# Altium project piRack.PrjPCB
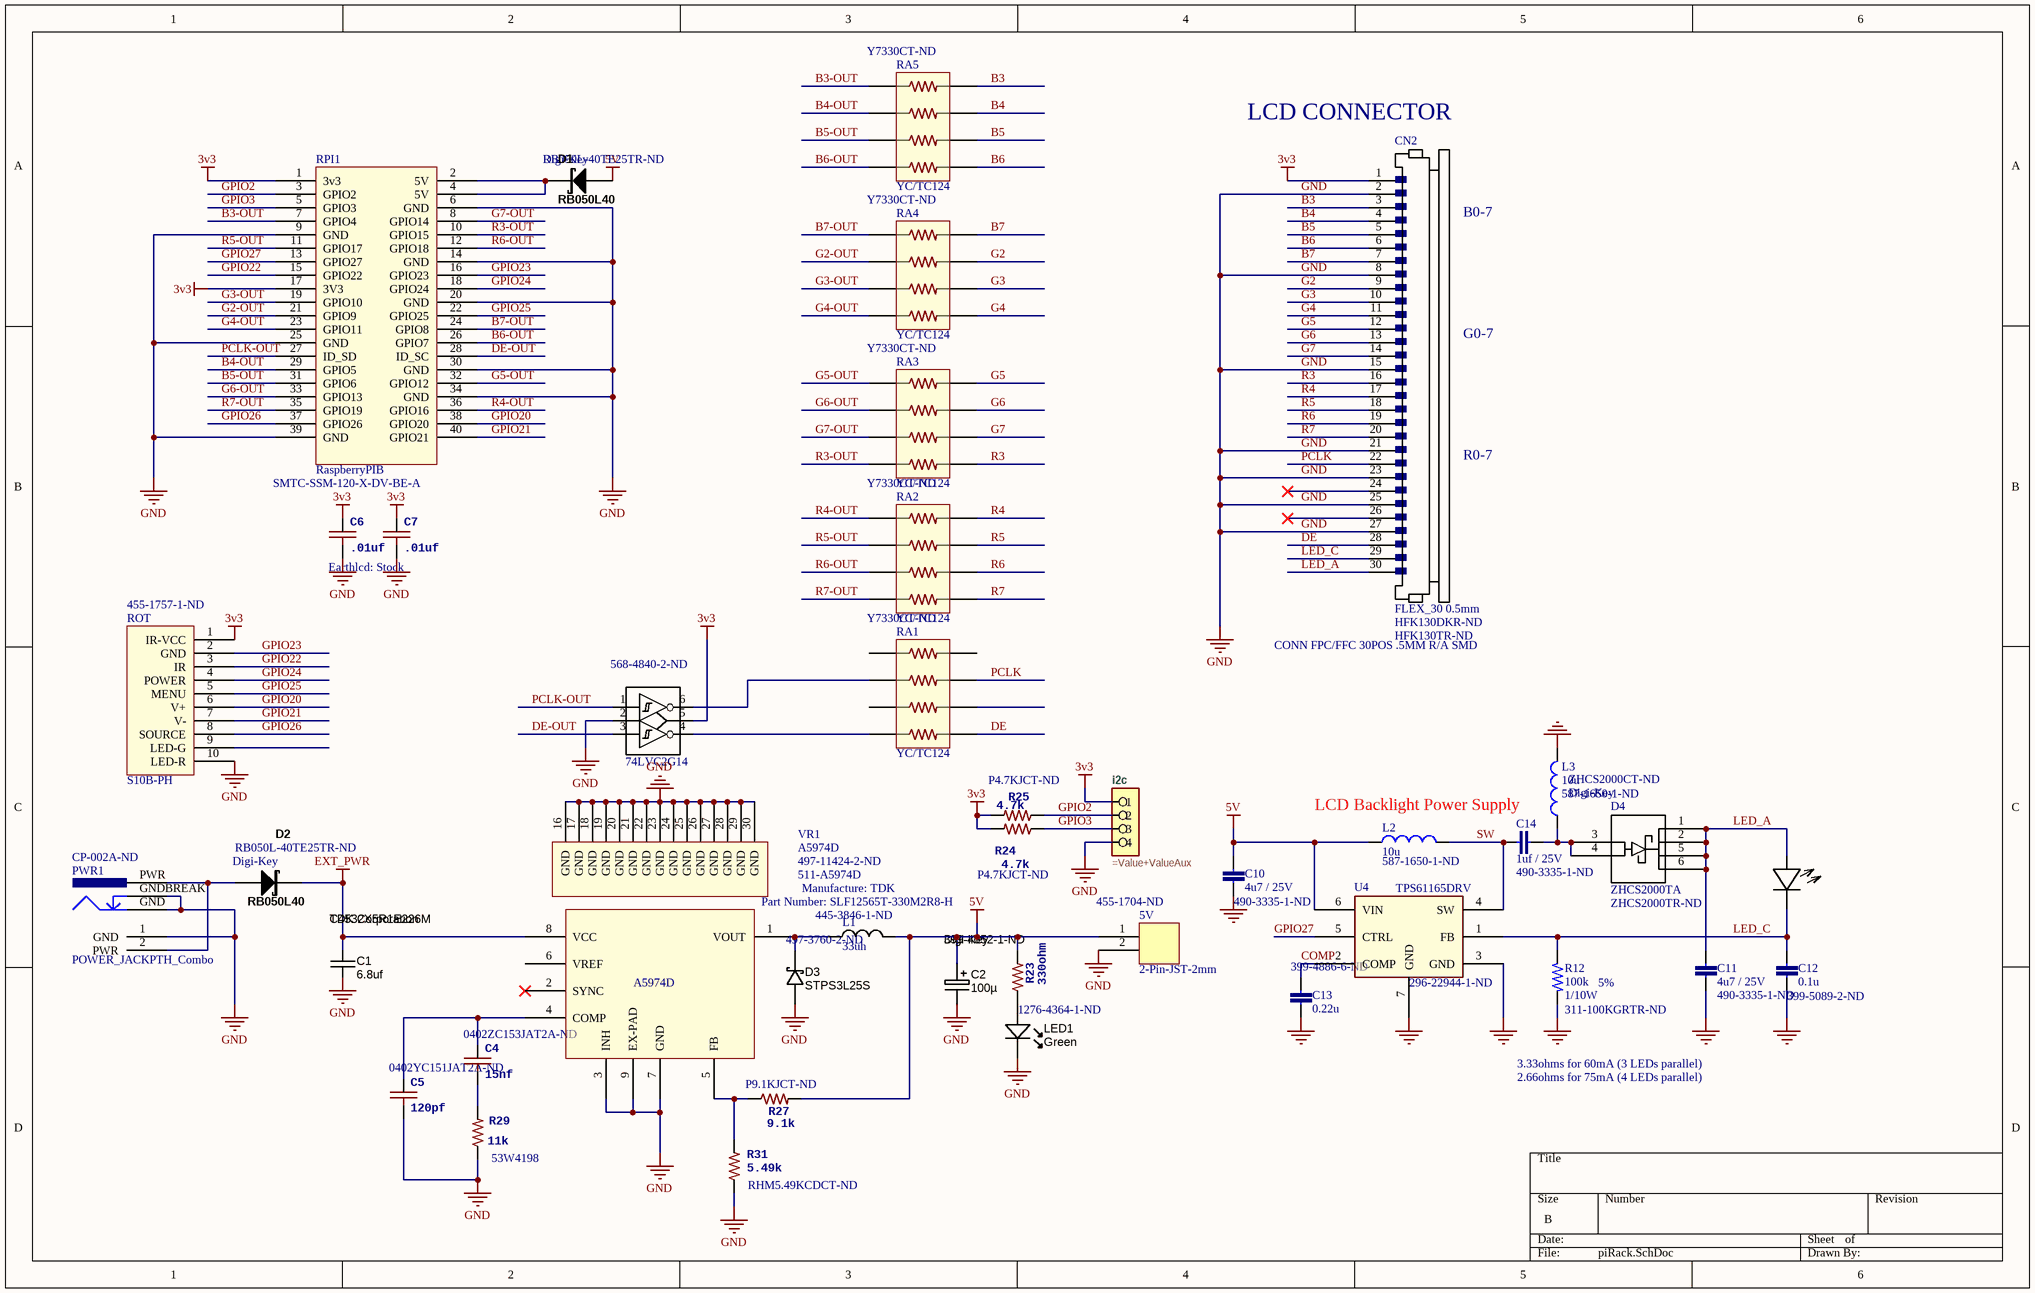
[diagram p0: piRack.SchDoc]
1 sheet, 40 parts. Net scope: global (net labels, ports and power ports of the same name join across sheets).
Board file: piRack.PcbDoc

## Sheet piRack.SchDoc
size B

### Parts
5V  2-Pin-JST-2mm  Supplier Part Number 1: 455-1704-ND  [2-pin-JST-2mm]
C1  value 6.8uf  Manufacturer 1: TDK Corporation  Manufacturer Part Number 1: C4532X5R1E226M  [CAPC4532X280N]  (hidden comment: approved sub OK)
C2  Supplier 1: Digi-Key  Supplier Part Number 1: 399-4052-1-ND  [CAPMP7343X310N]  (hidden comment: 100µ)
C4  15nf  Supplier Part Number 1: 0402ZC153JAT2A-ND  [0402C]
C5  120pf  Supplier Part Number 1: 0402YC151JAT2A-ND  [0402C]
C6  .01uf  Earthlcd: Stock  [0402C]
C7  .01uf  [0402C]
C10  4u7 / 25V  Supplier Part Number 1: 490-3335-1-ND  [C0805]
C11  4u7 / 25V  Supplier Part Number 1: 490-3335-1-ND  [C0805]
C12  0.1u  Supplier Part Number 1: 399-5089-2-ND  [0402c]
C13  0.22u  Supplier Part Number 2: 399-4886-6-ND  [0402c]
C14  1uf / 25V  Supplier Part Number 1: 490-3335-1-ND  [C0805]
CN2  FLEX_30 0.5mm  Supplier Part Number 1: HFK130DKR-ND  Supplier Part Number 2: HFK130TR-ND  [FH12A-30S-0.5H(55)]
D1  RB050L40  Supplier 1: Digi-Key  Supplier Part Number 1: RB050L-40TE25TR-ND  [SOD-106]
D2  RB050L40  Supplier 1: Digi-Key  Supplier Part Number 1: RB050L-40TE25TR-ND  [SOD-106]
D3  Ratings: STPS3L25S  Supplier Part Number 2: 497-3760-2-ND  [DO-214AB]  (hidden comment: DIODE_SCHOTTKY_30BQ100TRPBF)
D4  ZHCS2000TA  Supplier 1: Digi-Key  Supplier Part Number 1: ZHCS2000TR-ND  Supplier Part Number 2: ZHCS2000CT-ND  [SOT23-6]
i2c  (no value)  [JMP1X4-F180_2.54]
L1  33uh  Manufacture: TDK  Part Number: SLF12565T-330M2R8-H  Supplier Part Number 1: 445-3846-1-ND  [SLF6025]
L2  10u  Supplier Part Number 1: 587-1650-1-ND  [IND-NR6045]
L3  10u  Supplier Part Number 1: 587-1650-1-ND  [IND-NR6045]
LED1  Green  [LED-0603-GREEN]
PWR1  POWER_JACKPTH_Combo  Supplier Part Number 1: CP-002A-ND  [POWER_JACK_PTH - Combo]
R12  Wattage: 1/10W  Tolerance: 5%  Supplier Part Number 1: 311-100KGRTR-ND  [0402r]  (hidden comment: 100k)
R23  330ohm  Supplier Part Number 1: 1276-4364-1-ND  [0402R]
R24  4.7k  Supplier Part Number 1: P4.7KJCT-ND  [0402R]
R25  4.7k  Supplier Part Number 1: P4.7KJCT-ND  [0402R]
R27  9.1k  Supplier Part Number 1: P9.1KJCT-ND  [0402R]
R29  11k  Supplier Part Number 1: 53W4198  [0402R]
R31  5.49k  Supplier Part Number 1: RHM5.49KCDCT-ND  [0402R]
RA1  YC/TC124  Supplier Part Number 1: Y7330CT-ND  [YC/TC124]
RA2  YC/TC124  Supplier Part Number 1: Y7330CT-ND  [YC/TC124]
RA3  YC/TC124  Supplier Part Number 1: Y7330CT-ND  [YC/TC124]
RA4  YC/TC124  Supplier Part Number 1: Y7330CT-ND  [YC/TC124]
RA5  YC/TC124  Supplier Part Number 1: Y7330CT-ND  [YC/TC124]
ROT  S10B-PH  Supplier Part Number 1: 455-1757-1-ND  [PH-SM4]
RPI1  RaspberryPIB  [SMTC-SSM-120-X-DV-BE-A]
U4  TPS61165DRV  Supplier Part Number 1: 296-22944-1-ND  [SON-6]
VR1  A5974D  Supplier Part Number 1: 497-11424-2-ND  Supplier Part Number 2: 511-A5974D  [HSOP8]
  74LVC2G14  Supplier Part Number 1: 568-4840-2-ND  [SOT23-6]

### Nets
3v3: C6.1 C7.1 CN2.1 i2c.1 R24.2 R25.2 ROT.1(IR-VCC) RPI1.1(3v3) RPI1.17(3V3) .5
5V: 5V.1 C2.1 C10.1 D1.A L1.2 L2.1 R23.2 R27.2 U4.6(VIN)
EXT_PWR: C1.1 D2.K VR1.8(VCC)
GND: 5V.2 C1.2 C2.2 C5.2 C6.2 C7.2 C10.2 C11.1 C12.2 C13.2 CN2.2 CN2.8 CN2.15 CN2.21 CN2.23 CN2.25 CN2.27 D3.A i2c.4 L3.2 LED1.K PWR1.1(GND) PWR1.GND PWR1.GNDBREAK R12.1 R29.1 R31.1 ROT.10(LED-R) RPI1.6(GND) RPI1.9(GND) RPI1.14(GND) RPI1.20(GND) RPI1.25(GND) RPI1.30(GND) RPI1.34(GND) RPI1.39(GND) U4.3(GND) U4.7(GND) VR1.3(INH) VR1.7(GND) VR1.9(EX-PAD) VR1.16(GND) VR1.17(GND) VR1.18(GND) VR1.19(GND) VR1.20(GND) VR1.21(GND) VR1.22(GND) VR1.23(GND) VR1.24(GND) VR1.25(GND) VR1.26(GND) VR1.27(GND) VR1.28(GND) VR1.29(GND) VR1.30(GND) .2
B3: CN2.3 RA5.8
B3-OUT: RA5.1 RPI1.7(GPIO4)
B4: CN2.4 RA5.7
B4-OUT: RA5.2 RPI1.29(GPIO5)
B5: CN2.5 RA5.6
B5-OUT: RA5.3 RPI1.31(GPIO6)
B6: CN2.6 RA5.5
B6-OUT: RA5.4 RPI1.26(GPIO7)
B7: CN2.7 RA4.8
B7-OUT: RA4.1 RPI1.24(GPIO8)
COMP: C13.1 U4.2(COMP)
DE: CN2.28 RA1.5
DE-OUT: RPI1.28(ID_SC) .3
G2: CN2.9 RA4.7
G2-OUT: RA4.2 RPI1.21(GPIO9)
G3: CN2.10 RA4.6
G3-OUT: RA4.3 RPI1.19(GPIO10)
G4: CN2.11 RA4.5
G4-OUT: RA4.4 RPI1.23(GPIO11)
G5: CN2.12 RA3.8
G5-OUT: RA3.1 RPI1.32(GPIO12)
G6: CN2.13 RA3.7
G6-OUT: RA3.2 RPI1.33(GPIO13)
G7: CN2.14 RA3.6
G7-OUT: RA3.3 RPI1.8(GPIO14)
GPIO2: i2c.2 R25.1 RPI1.3(GPIO2)
GPIO3: i2c.3 R24.1 RPI1.5(GPIO3)
GPIO20: ROT.6(V+) RPI1.38(GPIO20)
GPIO21: ROT.7(V-) RPI1.40(GPIO21)
GPIO22: ROT.3(IR) RPI1.15(GPIO22)
GPIO23: ROT.2(GND) RPI1.16(GPIO23)
GPIO24: ROT.4(POWER) RPI1.18(GPIO24)
GPIO25: ROT.5(MENU) RPI1.22(GPIO25)
GPIO26: ROT.8(SOURCE) RPI1.37(GPIO26)
GPIO27: RPI1.13(GPIO27) U4.5(CTRL)
LED_A: C11.2 CN2.30 D4.1 D4.2 D4.5 D4.6
LED_C: C12.1 CN2.29 R12.2 U4.1(FB)
PCLK: CN2.22 RA1.7
PCLK-OUT: RPI1.27(ID_SD) .1
R3: CN2.16 RA3.5
R3-OUT: RA3.4 RPI1.10(GPIO15)
R4: CN2.17 RA2.8
R4-OUT: RA2.1 RPI1.36(GPIO16)
R5: CN2.18 RA2.7
R5-OUT: RA2.2 RPI1.11(GPIO17)
R6: CN2.19 RA2.6
R6-OUT: RA2.3 RPI1.12(GPIO18)
R7: CN2.20 RA2.5
R7-OUT: RA2.4 RPI1.35(GPIO19)
SW: C14.1 L2.2 U4.4(SW)
NetC4_1: C4.1 C5.1 VR1.4(COMP)
NetC4_2: C4.2 R29.2
NetC14_2: C14.2 D4.3 D4.4 L3.1
NetD1_K: D1.K RPI1.2(5V) RPI1.4(5V)
NetD2_A: D2.A PWR1.2(PWR) PWR1.PWR
NetD3_K: D3.K L1.1 VR1.1(VOUT)
NetLED1_A: LED1.A R23.1
NetR27_1: R27.1 R31.2 VR1.5(FB)
NetRA1_2: RA1.2 .6
NetRA1_4: RA1.4 .4

Not connected (* = marked no-connect by the designer): CN2 24* 26*; RA1 1 3 6 8; ROT 9(LED-G); VR1 2(SYNC)* 6(VREF)

### Notes on the sheet
- LCD CONNECTOR
- B0-7
- G0-7
- R0-7
- CONN FPC/FFC 30POS .5MM R/A SMD
- LCD Backlight Power Supply
- 3.33ohms for 60mA (3 LEDs parallel)
- 2.66ohms for 75mA (4 LEDs parallel)

### Library data of the parts
C1 = CAPC_22u_1812_25V: TDK C4532X5R1H685M; Tolerance: ±20%; Ratings: 25V; X5R; Material: ceramic; SCDType: undef; Package / Case: 1812 (4532 metric); Supplier 1: Digi-Key; Supplier Part Number 1: 445-1444-1-ND
C2 = CAPT_330u_2917_6V3: TPSC107M006R0150; Manufacturer Size Code: D; Manufacturer Part Number: T520D337M006ATE015; Ratings: 6.3V; Tolerance: ±20%; Material: Solid Tantalum; ESR (Equivalent Series Resistance): 15 mOhm; SCDType: spec; Package / Case: 2917 (7343 Metric); Operating Temperature: -55°C ~ 125°C; Size / Dimension: 0.287" L x 0.169" W (7.30mm x 4.30mm); Height - Seated (Max): 0.122" (3.10mm); ComponentLink1URL: http://www.kemet.com/datasheets&T520D337M006ATE015; ComponentLink1Description: T520D Datasheet; Value: 100µ
C4-C6 = C-USC0402
  C4 C5: Supplier 1: Digi-Key
C7 = C-USC0402: EarthLCD: Stock
C10 C11 C14 = C-EUC0805: Supplier 1: Digi-Key
C12 C13 = C-EUC0603: Supplier 1: Digi-Key
  C13: Supplier Part Number 1: 478-1245-2-ND; Supplier 2: Digi-Key
D1 D2 = RB050L40: Schottky Diode SOD106; Reel: D2
D3 = DIODE_SCHOTTKY_30BQ100TRPBF: Diode Schottky SMD 100V 3A SMC; Manufacturer 1: Vishay/Semiconductors; Material: Si; Speed: Fast Recovery =< 500ns, > 200mA (Io); SCDType: source; Package / Case: DO-214AB, SMC; Diode Type: Schottky; Mounting Type: Surface Mount; Supplier 1: Digi-Key; Manufacturer Part Number 1: 30BQ100TRPBF; Supplier Part Number 1: 30BQ100PBFCT-ND; Supplier 2: Digi-Key
i2c = JMP4: =Description
L1 = ELLCTV470M: Supplier 1: Digi-Key
L2 L3 = Inductor: Supplier 1: Digi-Key
LED1 = LED_SMD_Green_0603_570nm: LED 0603 SMD Green 570nm 50mcd 20mA; Manufacturer 1: Kingbright Company LLC; Manufacturer Part Number 1: LED-KPL3015SGC; Material: AlGaInP; Ratings: 20mcd min; 50 mcd typ; 570 nm; Voltage - Forward (Vf) Typ: 2.1V; Viewing Angle: 120°; Lens Style/Size: Rectangle with Flat Top, 1.1mm x 0.8mm; Voltage - Forward (Vf) @ 10mA: 2.0V; SCDType: source; Wavelength - Peak: 574nm; Lens Type: Clear; Package / Case: 0603 (1608 metric); Color: Green; Current - Test: 20mA; Supplier 1: Digi-Key; Supplier Part Number 1: 754-1116-1-ND; RoHS 1: RoHS Compliant; Wavelength - Dominant: 570nm; ComponentLink1URL: http://www.us.kingbright.com/images/catalog/SPEC/APT1608CGCK.pdf; ComponentLink1Description: http://www.us.kingbright.com/images/catalog/SPEC/APT1608CGCK.pdf
PWR1 = POWER_JACKPTH_Combo: Dual footprint for Jack and Jumper power; Supplier 1: Digi-Key
R12 = RES_0402_2512: Resistor 0402-2512; Value: 100k; Supplier 1: Digi-Key
R23-R25 R27 R29 R31 = R-US_R0402
  R23-R25 R27 R31: Supplier 1: Digi-Key
  R29: Supplier 1: Newark
RA1-RA5 = YC/TC124: Yaego YC/TC124 Resistor Array; Supplier 1: Digi-Key
RPI1 = RaspberryPIB: Harwin: M20-6112045; AdaFruit: 1992; Samtec: SMTC-SSM-120-X-DV-BE-A
5V = 2-Pin-JST-2mm: Supplier 1: Digi-Key
? = 74LVC2G14: Supplier 1: Digi-Key
CN2 = FLEX_30 0.5mm: Supplier 1: Digi-Key; Supplier 2: Digi-Key
D4 = ZHCS2000TA: Supplier 2: Digi-Key
ROT = S10B-PH: Supplier 1: Digi-Key
U4 = TPS61165DRV: Supplier 1: Digi-Key
VR1 = A5974D: Supplier 1: Digi-Key; Supplier 2: Mouser